# Altium schematic sheet ATACS_SCH.SchDoc
size A
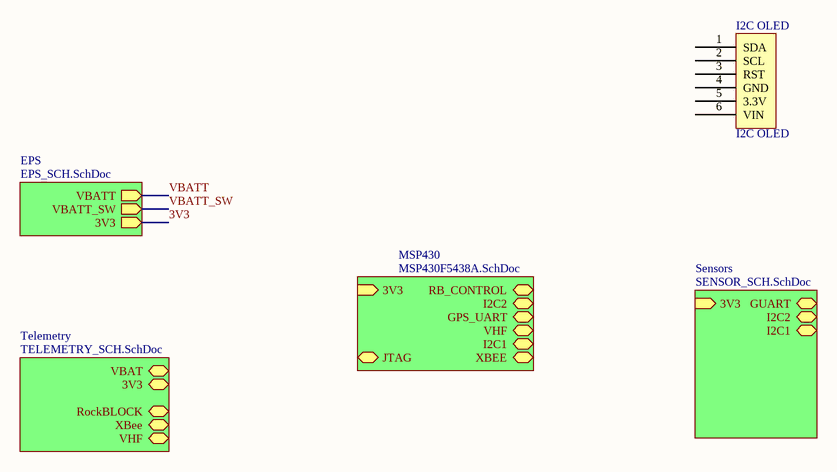
[diagram p0: ATACS_SCH.SchDoc]

## Parts
I2C_OLED  I2C OLED

## Sub-sheets
EPS = EPS_SCH.SchDoc: 3V3 (out), VBATT (out), VBATT_SW (out)
MSP430 = MSP430F5438A.SchDoc: RB_CONTROL (harness RockBLOCK), I2C2 (harness I2C), GPS_UART (harness UART), JTAG (harness JTAG), VHF (harness APRS Transmitter), I2C1 (harness I2C), XBEE (harness Short-Range XBee), 3V3 (in)
Sensors = SENSOR_SCH.SchDoc: 3V3 (in), GUART (harness Harness), I2C2 (harness I2C), I2C1 (harness I2C)
Telemetry = TELEMETRY_SCH.SchDoc: VBAT, 3V3, XBee (harness XBee), VHF (harness VHF), RockBLOCK (harness RockBLOCK)

## Nets
3V3: sheet EPS/3V3
VBATT: sheet EPS/VBATT
VBATT_SW: sheet EPS/VBATT_SW

Not connected (* = marked no-connect by the designer): I2C_OLED 1(SDA) 2(SCL) 3(RST) 4(GND) 5(3.3V) 6(VIN)

## Library data of the parts
I2C_OLED = I2C OLED: Adafruit 931